# EAGLE design 1-cell-mcu (EAGLE 8.5.2)
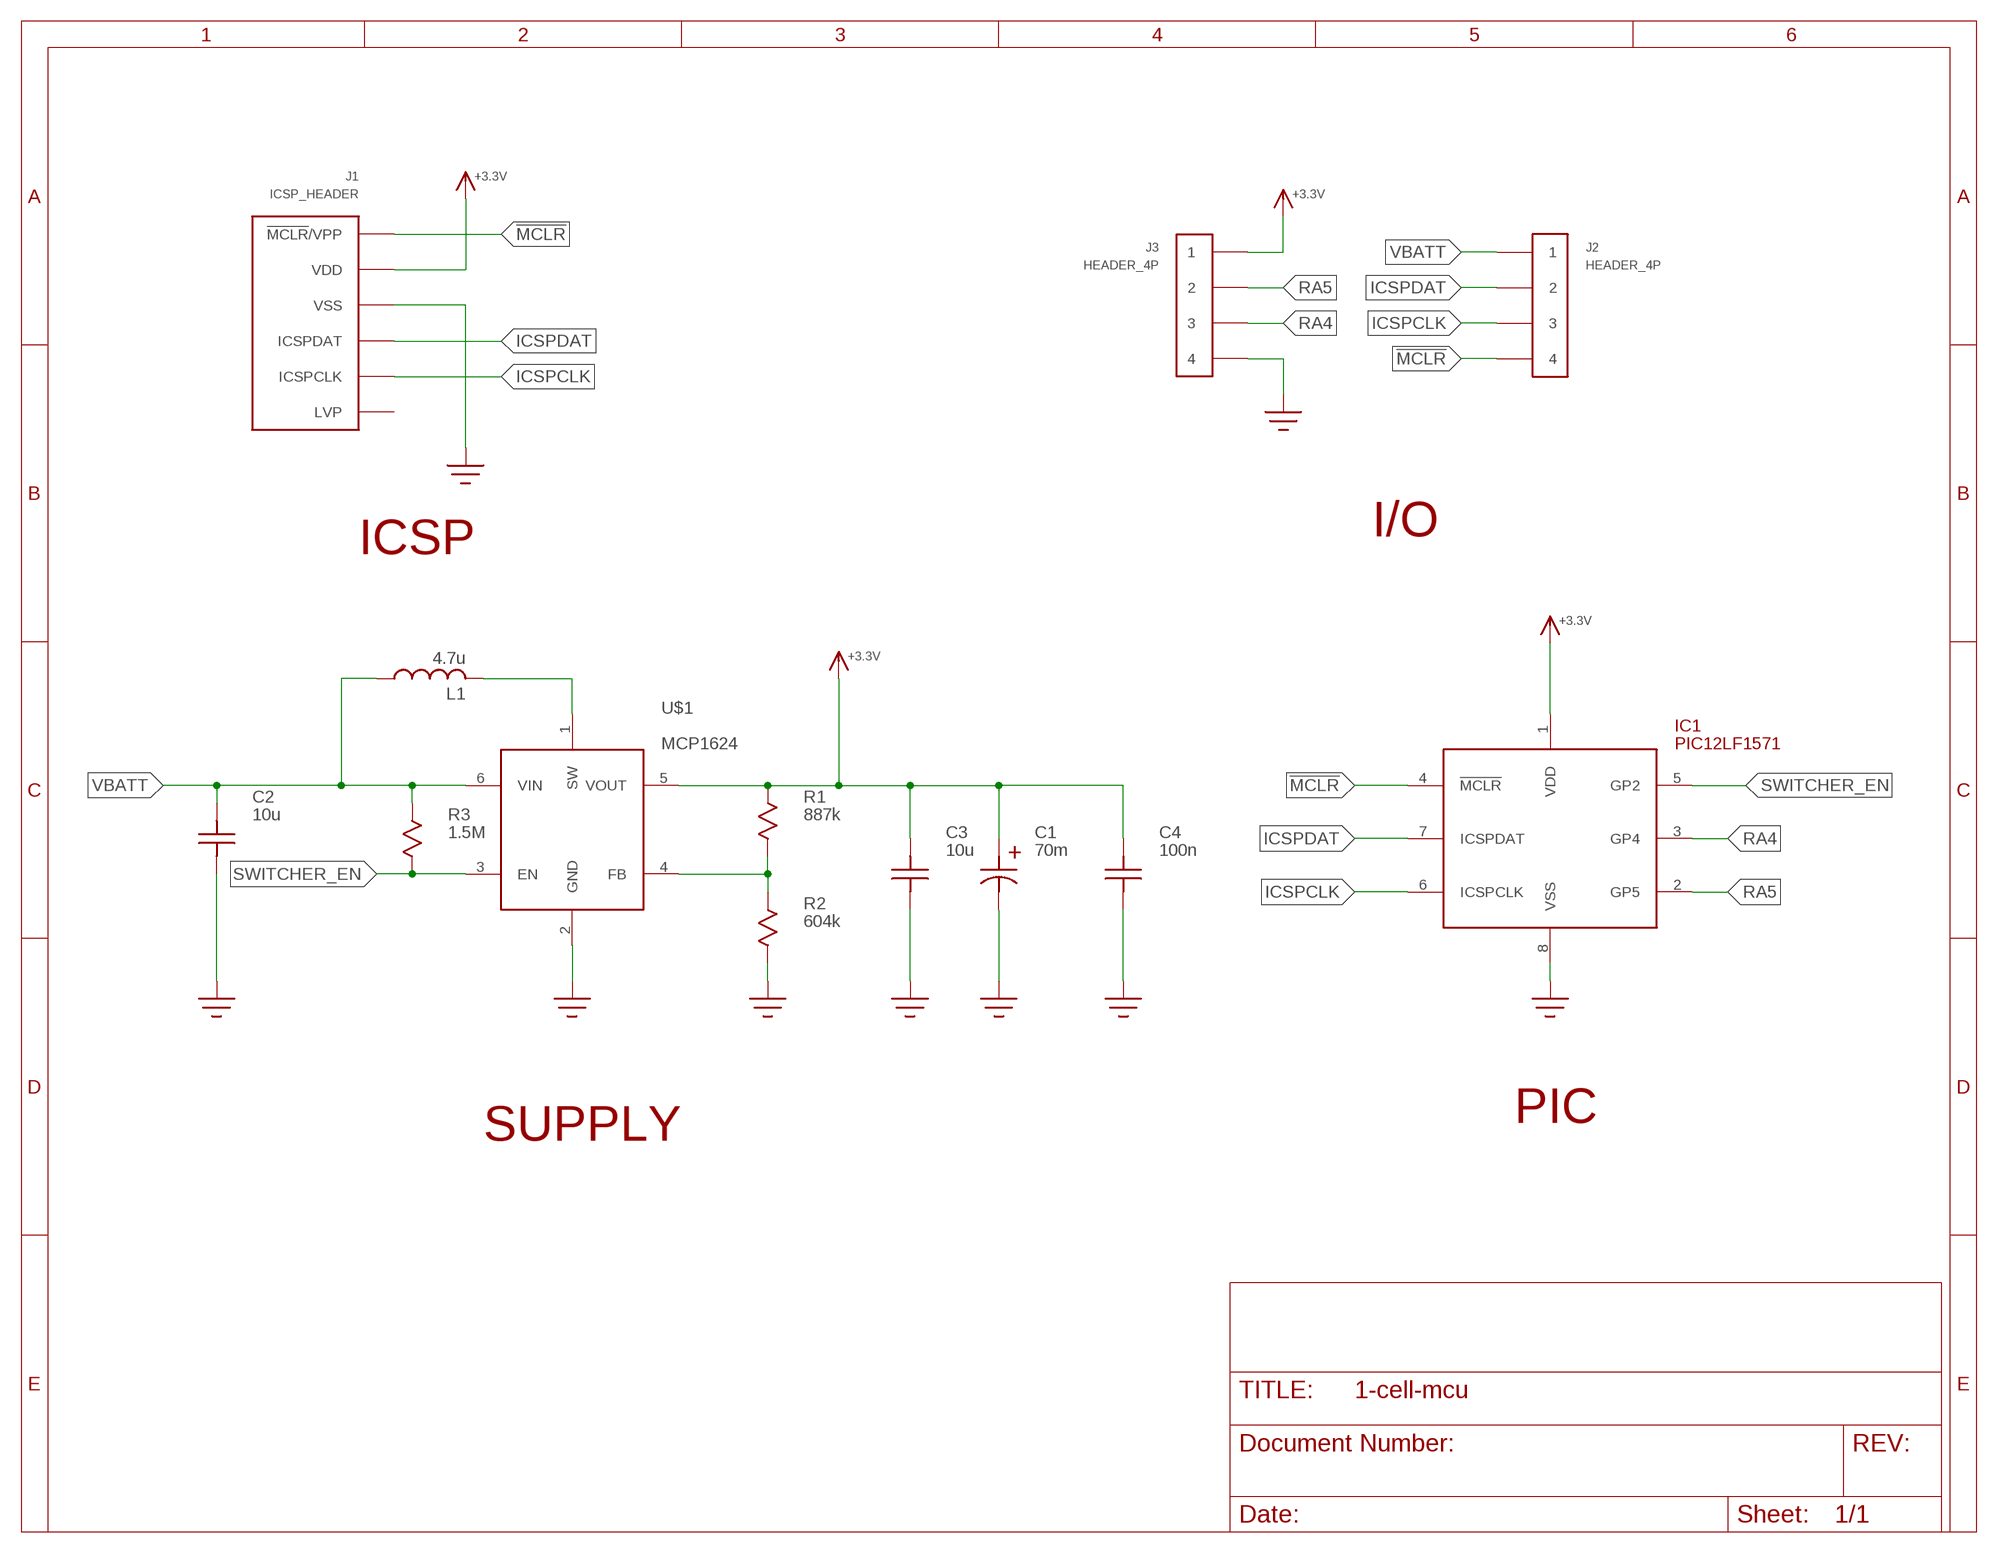
[diagram p0: schematic, sheet 1]

## Parts
C1  70m  C_POL  [ELNA_HL_SUPERCAP]
C2  10u  C1206  [1206]
C3  10u  C1206  [1206]
C4  100n  C0805  [0805]
IC1  PIC12LF1571  [SOIC8]
J1  ICSP_HEADER  [HEADER_6P]
J2  HEADER_4P  [HEADER_4P]
J3  HEADER_4P  [HEADER_4P]
L1  4.7u  INDUCTOR4040  [4040_INDUCTOR]
R1  887k  R0805  [R0805]
R2  604k  R0805  [R0805]
R3  1.5M  R0805  [R0805]
U$1  MCP1624  [SOT23-6]

## Nets
!MCLR!: IC1.4(!MCLR!) J1.1(!MCLR!/VPP) J2.4
+3.3V: C1.+ C3.P$2 C4.P$2 IC1.1(VDD) J1.2(VDD) J3.1 R1.P$1 U$1.5(VOUT)
GND: C1.- C2.P$1 C3.P$1 C4.P$1 IC1.8(VSS) J1.3(VSS) J3.4 R2.P$2 U$1.2(GND)
ICSPCLK: IC1.6(ICSPCLK) J1.5(ICSPCLK) J2.3
ICSPDAT: IC1.7(ICSPDAT) J1.4(ICSPDAT) J2.2
N$2: L1.P$2 U$1.1(SW)
N$5: R1.P$2 R2.P$1 U$1.4(FB)
RA4: IC1.3(GP4) J3.3
RA5: IC1.2(GP5) J3.2
SWITCHER_EN: IC1.5(GP2) R3.P$2 U$1.3(EN)
VBATT: C2.P$2 J2.1 L1.P$1 R3.P$1 U$1.6(VIN)
Unconnected: J1.6(LVP)

## Notes on the sheet
- I/O
- ICSP
- PIC
- SUPPLY

## Library data of the parts
C1 = 1-cell-mcu:C_POL
C2-C4 = 1-cell-mcu:C
IC1 = 1-cell-mcu:PIC12LF1571
J1 = 1-cell-mcu:ICSP_HEADER
J2 J3 = 1-cell-mcu:HEADER_4P
L1 = 1-cell-mcu:INDUCTOR
R1-R3 = 1-cell-mcu:R
U$1 = 1-cell-mcu:MCP1624

## Board
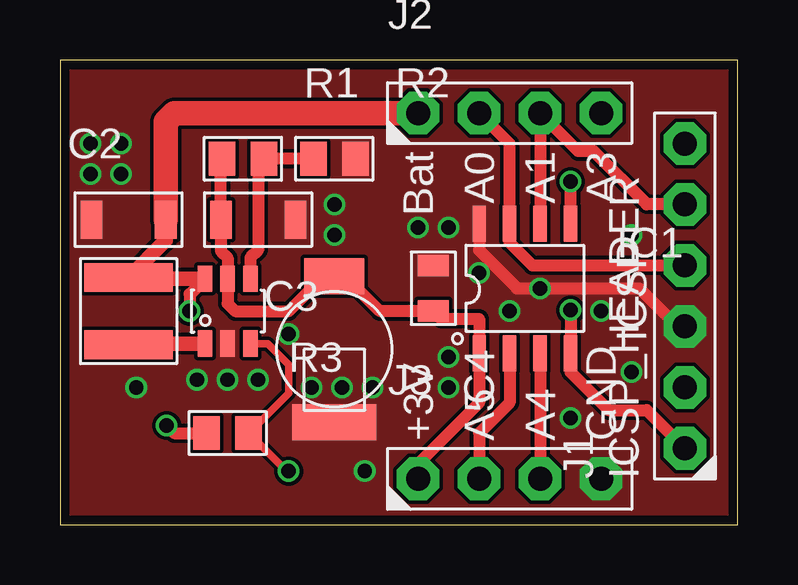
[diagram p1: board, top side]
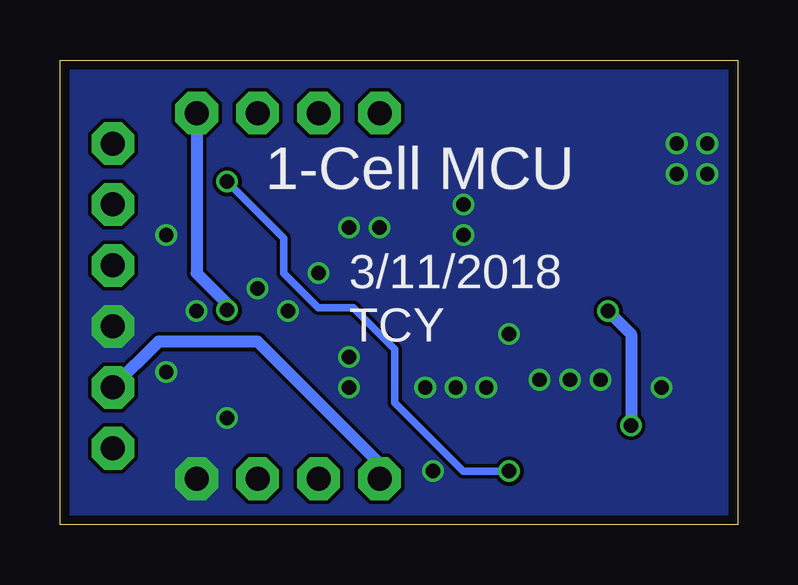
[diagram p2: board, bottom side, seen from below]

Size 28.24 x 19.36 mm. Coordinates in mm from the lower left corner, seen from the top.
Outline: 0,0 28.24,0 28.24,19.36 0,19.36 0,0
Copper layers (1*16): Top 0.035559375mm / dielectric 1.6mm / Bottom 0.035559375mm
Design rules "oshpark-2layer *": minimum track width 6mil, minimum drill 10mil, track to track 6mil, track to pad 6mil, pad to pad 6mil, via to via 6mil, smd to smd 6mil, copper to edge 15mil, drill to drill 6mil, minimum pad ring 5mil, minimum via ring 5mil, stop-mask expansion 2.5mil, vias tented up to drill 35mil, thermal gap 10mil

### Footprints (pad centres in the part's own frame; a part is rotated, then mirrored left to right if it is on the bottom)
ELNA_HL_SUPERCAP = smd 2.5 x 1.5: + 0,3.05 | smd 3.5 x 1.5: - 0,-3.05
1206 = smd 0.9 x 1.6: P$1 -1.55,0; P$2 1.55,0
0805 = smd 0.9 x 1.3: P$1 -0.95,0; P$2 0.95,0
SOIC8 = smd 0.55 x 1.5: 1 -1.905,-2.7; 2 -0.635,-2.7; 3 0.635,-2.7; 4 1.905,-2.7; 5 1.905,2.7; 6 0.635,2.7; 7 -0.635,2.7; 8 -1.905,2.7
HEADER_6P = drill 1 pad 1.778 octagon: 1 -6.35,0; 2 -3.81,0; 3 -1.27,0; 4 1.27,0; 5 3.81,0; 6 6.35,0
HEADER_4P = drill 1 pad 1.778 octagon: 1 -3.81,0; 2 -1.27,0; 3 1.27,0; 4 3.81,0
4040_INDUCTOR = smd 1.2 x 3.7: P$1 -1.4,0; P$2 1.4,0
R0805 = smd 1.1 x 1.4: P$1 -0.875,0; P$2 0.875,0
SOT23-6 = smd 0.6 x 1.1: 1 -0.95,-1.35; 2 0,-1.35; 3 0.95,-1.35; 4 0.95,1.35; 5 0,1.35; 6 -0.95,1.35

### Placement (x,y rotation side)
C1  220m  [ELNA_HL_SUPERCAP]  11.43,7.3 0 top
C2  2.86,12.7 0 top
C3  8.26,12.7 180 top
C4  15.56,9.84 270 top
IC1  19.37,9.84 0 top
J1  26.04,9.53 90 top
J2  18.73,17.14 0 top
J3  18.73,1.91 0 top
L1  2.86,8.89 270 top
R1  7.62,15.24 0 top
R2  11.43,15.24 0 top
R3  6.99,3.81 0 top
U$1  6.99,8.89 0 top

### Tracks (layer width: path | path; a pad name or v marks a point on that pad's centre or on a via)
!MCLR!  (via drill 0.6)
  Top 0.508: J1.1 24.45,4.76 22.86,4.76 21.27,6.35 IC1.4 v21.27,8.93
  Bottom 0.508: J2.4 22.54,10.48 21.27,9.21 v21.27,8.93
+3.3V
  Top 0.508: R1.P$1 6.71,15.2 C3.P$2 6.71,11.39 6.99,11.11 U$1.5 6.99,9.21 7.3,8.89 9.53,8.89 10.99,10.35 C1.+ 11.87,10.35 13.33,8.89 C4.P$2 15.88,8.57 17.46,8.57 IC1.1 17.46,5.08 14.92,2.54 J3.1
  Top 0.61: 15.71,8.89 C4.P$2
  Bottom 0.508: J3.1 14.92,2.54 20,7.62 24.13,7.62 J1.2
GND  (via drill 0.6)
  Top 0.508: IC1.8 17.46,11.43 19.05,9.84 24.13,9.84 25.72,8.26 J1.3
  other vias: 17.46,10.48 8.26,6.03 5.71,6.03 6.99,6.03 18.73,8.89 14.92,12.38 16.19,12.38 11.43,13.34 11.43,12.06 1.27,14.61 2.54,14.61 2.54,15.88 1.27,15.88 10.48,5.71 11.75,5.71 13.02,5.71 3.17,5.71 12.7,2.22 22.54,8.89 20,9.84 23.81,12.06 21.27,4.45 16.19,6.99 16.19,5.71 23.81,6.35 9.53,7.94
  pour Top (no thermals): 0,0 28.26,0 28.26,19.37 0,19.37
  pour Bottom (no thermals): 0,0 28.26,0 28.26,19.37 0,19.37
ICSPCLK
  Top 0.508: IC1.6 J2.3 21.59,15.56 22.23,15.56 24.45,13.34 J1.5
ICSPDAT
  Top 0.508: J1.4 19.68,10.79 18.73,11.75 IC1.7 18.73,15.88 J2.2
N$2
  Top 0.61: U$1.1 2.91,7.54 L1.P$2
N$5
  Top 0.508: R2.P$1 R1.P$2 8.26,15 8.26,11.43 7.93,11.11 U$1.4
RA4
  Top 0.508: IC1.3 J3.3
RA5
  Top 0.508: IC1.2 18.73,5.08 17.46,3.81 J3.2
SWITCHER_EN  (via drill 0.6)
  Top 0.305: U$1.3 8.65,7.54 9.53,6.67 9.53,5.47 R3.P$2 9.45,2.22 v9.53,2.22
  Top 0.508: IC1.5 v21.27,14.29
  Bottom 0.305: v21.27,14.29 18.91,11.92 18.91,10.46 17.48,9.03 16.02,9.03 14.29,7.3 14.29,5.08 11.43,2.22 v9.53,2.22
VBATT  (via drill 0.6)
  Top 0.508: U$1.6 5.4,9.6 v5.4,8.89 | v4.45,4.13 4.76,3.81 R3.P$1
  Top 0.61: U$1.6 2.91,10.24 L1.P$1 4.41,11.84 C2.P$2
  Top 1.016: J2.1 4.76,17.14 4.41,16.79 C2.P$2
  Bottom 0.508: v5.4,8.89 4.45,7.94 v4.45,4.13

### Text on the board
tPlace: Bat | A0 | A1 | A3 | ICSP | +3V | A5 | A4 | GND
bPlace: 1-Cell MCU | 3/11/2018 | TCY